# Altium schematic sheet Main board.SchDoc
size B; SheetNumber: 2; SheetTotal: 2
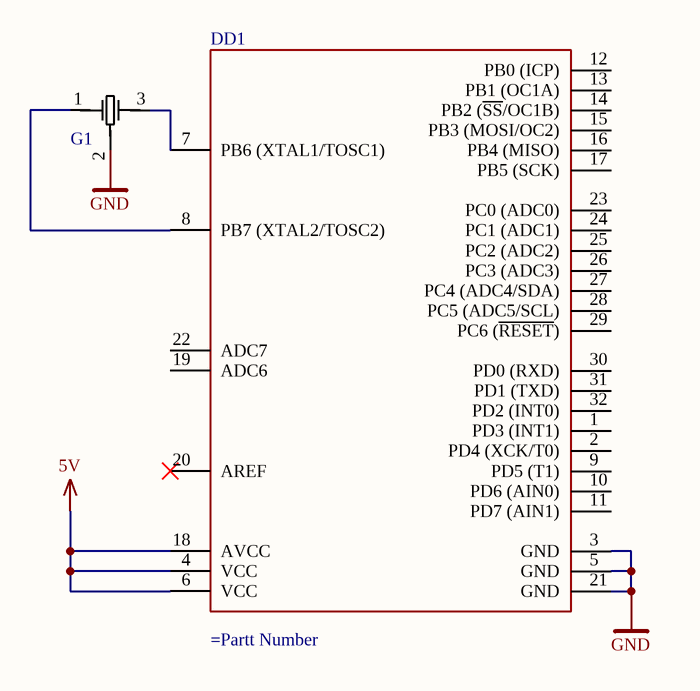
[diagram p0: Main board.SchDoc]

## Parts
DD1  (no value)  [TQFP32_N]
G1  8MHz 33pF  [CSTNE_G]  (value not drawn)

## Nets
5V: DD1.4(VCC) DD1.6(VCC) DD1.18(AVCC)
GND: DD1.3(GND) DD1.5(GND) DD1.21(GND) G1.2
NetDD1_7: DD1.7(PB6_(XTAL1/TOSC1)) G1.3
NetDD1_8: DD1.8(PB7_(XTAL2/TOSC2)) G1.1

Not connected (* = marked no-connect by the designer): DD1 1(PD3_(INT1)) 2(PD4_(XCK/T0)) 9(PD5_(T1)) 10(PD6_(AIN0)) 11(PD7_(AIN1)) 12(PB0_(ICP)) 13(PB1_(OC1A)) 14(PB2_(~{SS}/OC1B)) 15(PB3_(MOSI/OC2)) 16(PB4_(MISO)) 17(PB5_(SCK)) 19(ADC6) 20(AREF)* 22(ADC7) 23(PC0_(ADC0)) 24(PC1_(ADC1)) 25(PC2_(ADC2)) 26(PC3_(ADC3)) 27(PC4_(ADC4/SDA)) 28(PC5_(ADC5/SCL)) 29(PC6_(~{RESET})) 30(PD0_(RXD)) 31(PD1_(TXD)) 32(PD2_(INT0))

## Library data of the parts
DD1 = ATMEGA328: IC MCU 8BIT 32KB FLASH 32TQFP; Manufacturer Part Number: ATMEGA328PB-AU; Part Number: ATMEGA328; HelpURL: https://www.digikey.com/product-detail/en/microchip-technology/ATMEGA328PB-AU/ATMEGA328PB-AU-ND/5638812; Digi-Key Part Number: ATMEGA328PB-AU-ND
G1 = CSTNE8M00G550000R0: Resonators 8.0000MHz 33pF SMD CHP Resntr; Part Number: CSTNE8M00G550000R0; HelpURL: https://www.mouser.com/ProductDetail/Murata-Electronics/CSTNE8M00G550000R0?qs=sGAEpiMZZMsBj6bBr9Q9aZiWbAMN9VKZL2sPd%252BqabYTr9Kzmh3hi1Q%3D%3D; Price$: 0.148; Digi-Key Part Number: 490-17958-1-ND; Manufacturer Part Number: CSTNE8M00G550000R0; Package: SMD-3pin; Mouser Part Number: 81-CSTNE8M00G550000R